# Altium schematic sheet Sheet1.SchDoc
size A; SheetNumber: 1; SheetTotal: 1
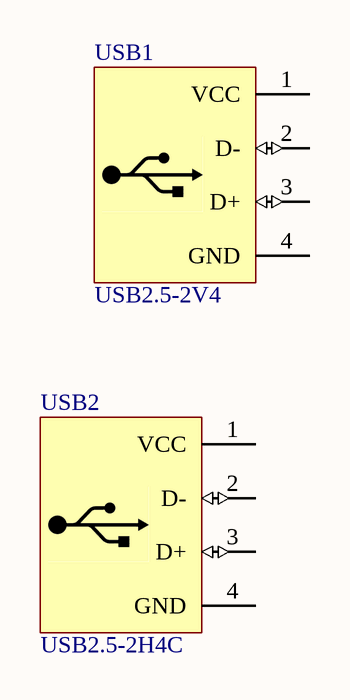
[diagram p0: Sheet1.SchDoc]

## Parts
USB1  USB2.5-2V4  [USB2.5-2V4]
USB2  USB2.5-2H4C  [USB2.5-2H4C]

## Nets

Not connected (* = marked no-connect by the designer): USB1 1(VCC) 2(D-) 3(D+) 4(GND); USB2 1(VCC) 2(D-) 3(D+) 4(GND)